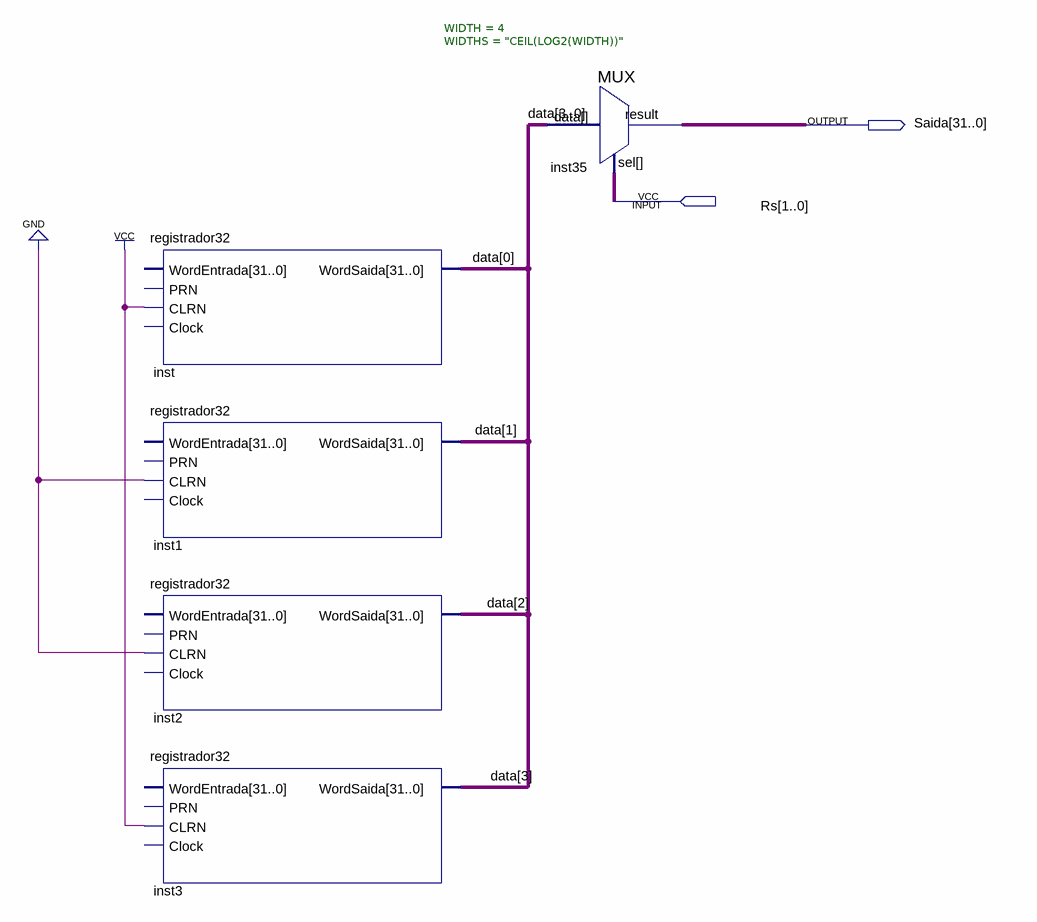
[diagram p0: schematic sheet]
// Quartus schematic TESTEBAGARAI.bdf as structural Verilog: 5 symbols, 2 pins
module TESTEBAGARAI (
  input  [1:0] Rs,
  output [31:0] Saida
);

  wire [3:0] data;

  registrador32 inst (.CLRN(1'b1), .WordSaida(data[0]));  // open: WordEntrada, PRN, Clock
  registrador32 inst1 (.CLRN(1'b0), .WordSaida(data[1]));  // open: WordEntrada, PRN, Clock
  registrador32 inst2 (.CLRN(1'b0), .WordSaida(data[2]));  // open: WordEntrada, PRN, Clock
  registrador32 inst3 (.CLRN(1'b1), .WordSaida(data[3]));  // open: WordEntrada, PRN, Clock
  MUX #(.WIDTH(4), .WIDTHS("CEIL(LOG2(WIDTH))")) inst35 (.data(data), .sel(Rs), .result(Saida));
endmodule
